# Altium schematic sheet Peripherals.SchDoc
size A3; SheetNumber: 3; SheetTotal: 10
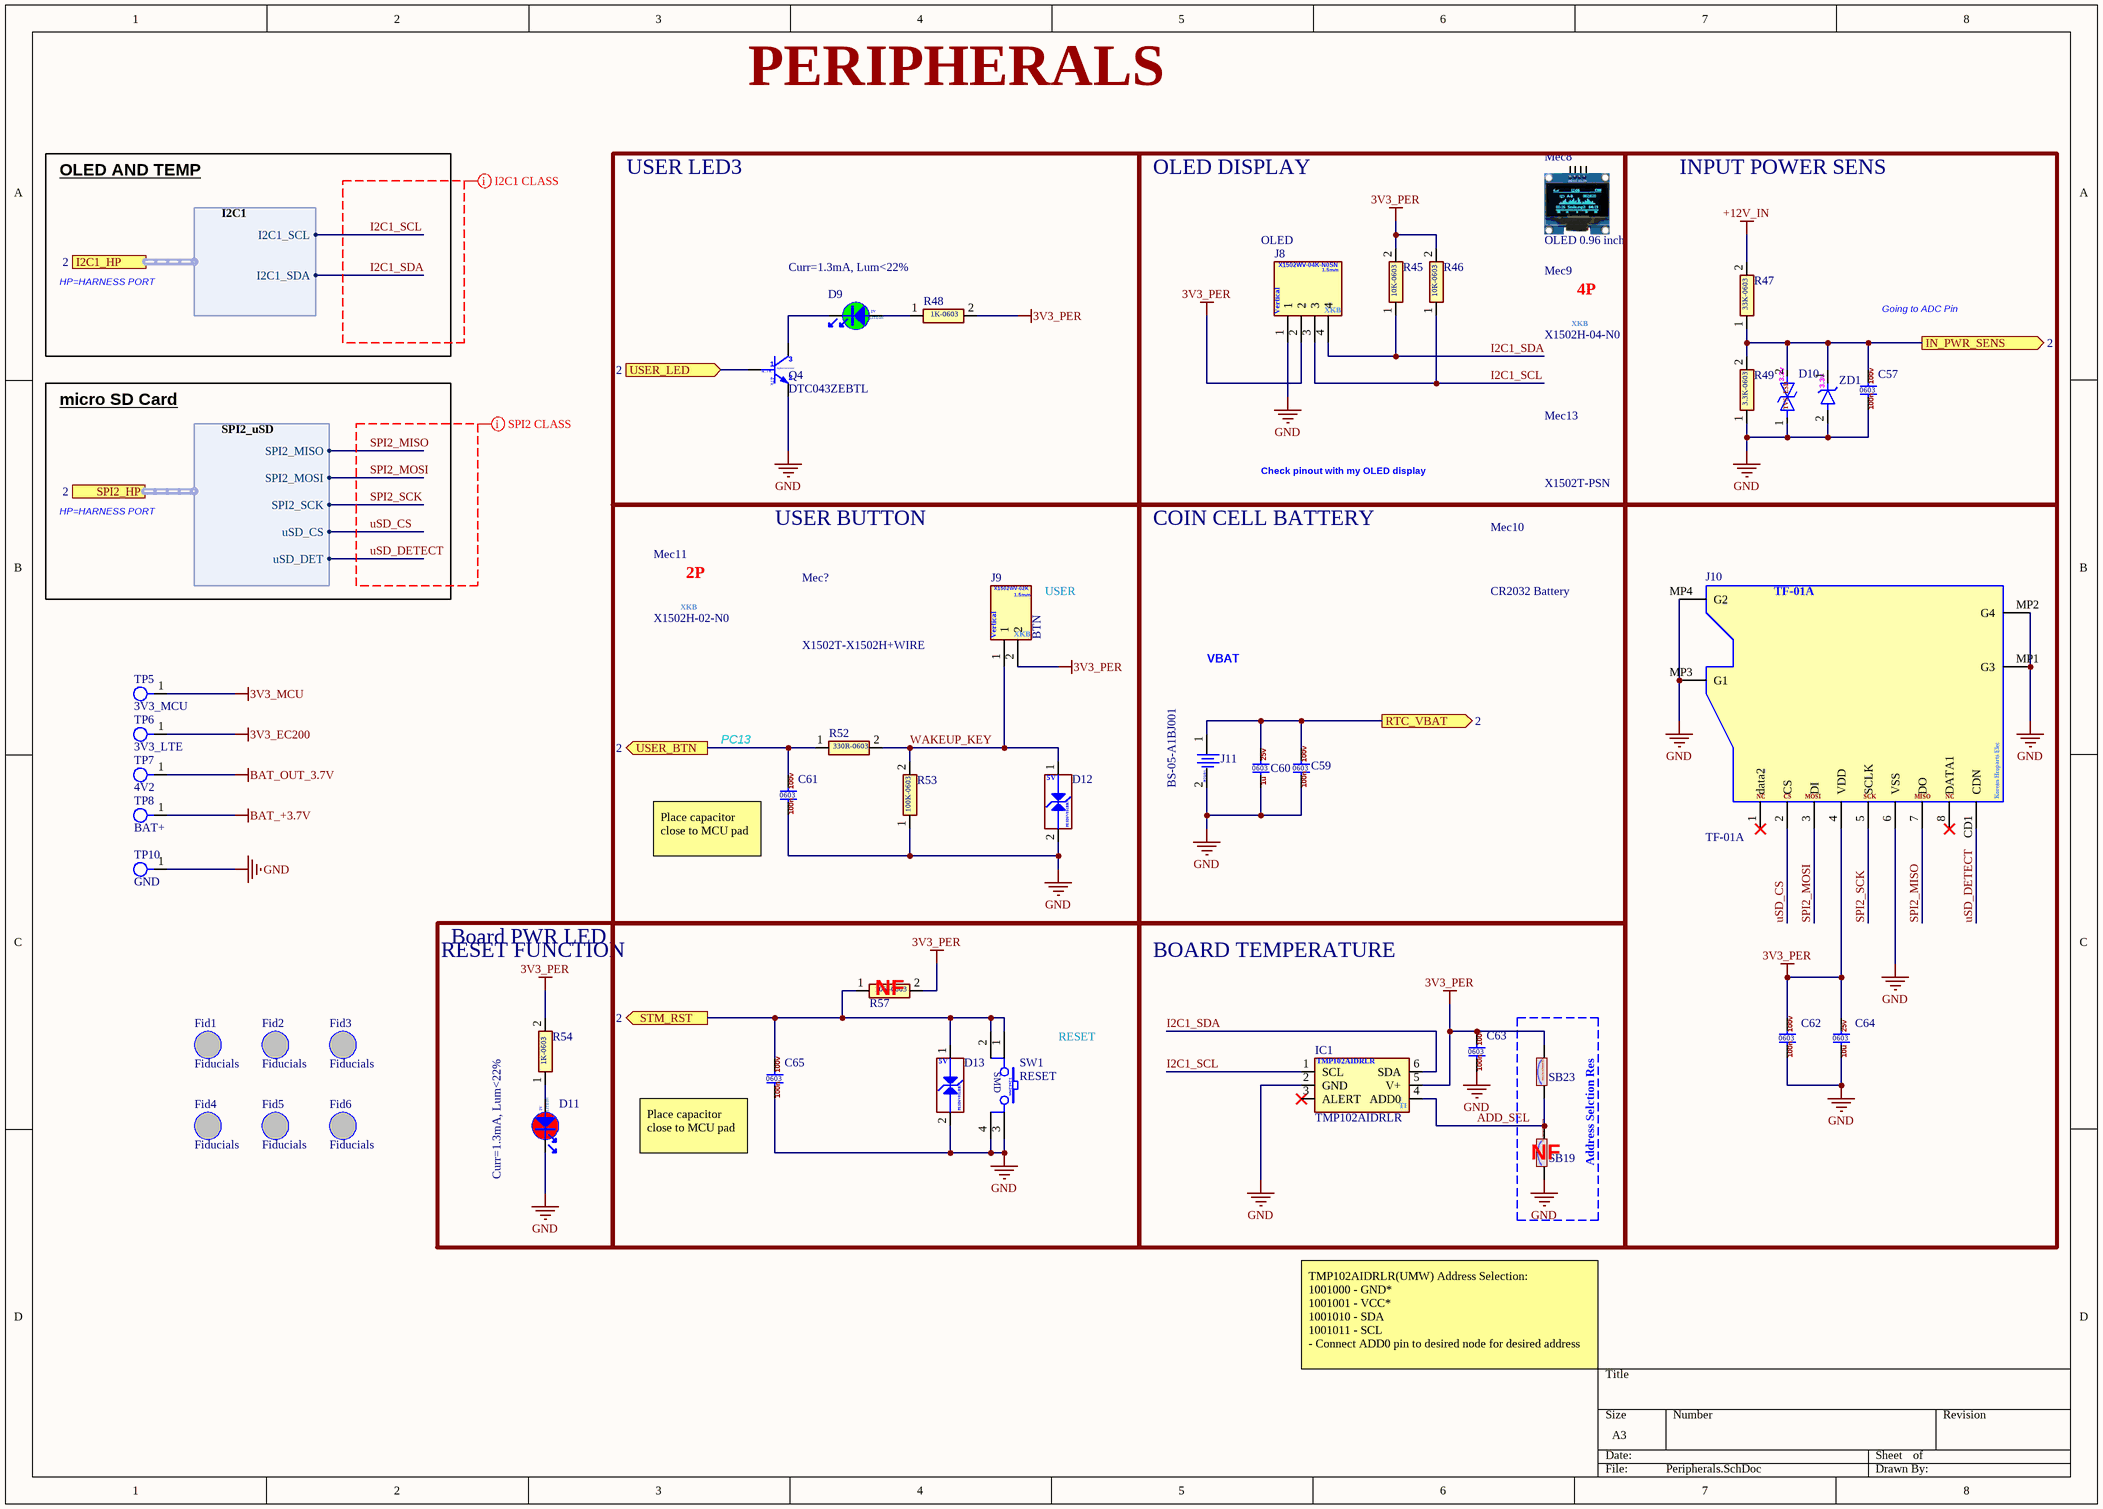
[diagram p0: Peripherals.SchDoc]

## Parts
C57  CL10B104KC8NNNC  [0603-CAP]  (value not drawn)
C59  CL10B104KC8NNNC  [0603-CAP]  (value not drawn)
C60  CL10B105KA8NNNC  [0603-CAP]  (value not drawn)
C61  CL10B104KC8NNNC  [0603-CAP]  (value not drawn)
C62  CL10B104KC8NNNC  [0603-CAP]  (value not drawn)
C63  CL10B104KC8NNNC  [0603-CAP]  (value not drawn)
C64  CL10A106MA8NRNC  [0603-CAP]  (value not drawn)
C65  CL10B104KC8NNNC  [0603-CAP]  (value not drawn)
D9  LTST-C170KGKT  [0805-LED-BLUE]  (value not drawn)
D10  UDD32C03L01  [SOD-323-2]  (value not drawn)
D11  LTST-C170KRKT  [0805-LED-RED]  (value not drawn)
D12  PESD5V0S1BBN  [SOD-523 SOD2512X110N]  (value not drawn)
D13  PESD5V0S1BBN  [SOD-523 SOD2512X110N]  (value not drawn)
Fid1  Fiducials  [Fiducials]
Fid2  Fiducials  [Fiducials]
Fid3  Fiducials  [Fiducials]
Fid4  Fiducials  [Fiducials]
Fid5  Fiducials  [Fiducials]
Fid6  Fiducials  [Fiducials]
IC1  TMP102AIDRLR  [SOT-563]
J8  OLED  [JST 4P 1.5MM VERTICAL]
J9  BTN  [JST 2P 1.5MM VERTICAL]
J10  TF-01A  [TF-01A]
J11  BS-05-A1BJ001  [BAT-TH_BS-05-A1BJ001]
Mec8  OLED 0.96 inch  (mechanical)
Mec9  X1502H-04-N0  (mechanical)
Mec10  CR2032 Battery  (mechanical)
Mec11  X1502H-02-N0  (mechanical)
Mec13  X1502T-PSN  (mechanical)
Mec?  X1502T-X1502H+WIRE  (mechanical)
Q4  DTC043ZEBTL  [SOT-416FL]
R45  0603WAF1002T5E  [0603-RES]  (value not drawn)
R46  0603WAF1002T5E  [0603-RES]  (value not drawn)
R47  0603WAF3302T5E  [0603-RES]  (value not drawn)
R48  0603WAF1001T5E  [0603-RES]  (value not drawn)
R49  0603WAF3301T5E  [0603-RES]  (value not drawn)
R52  0603WAF3300T5E  [0603-RES]  (value not drawn)
R53  0603WAF1003T5E  [0603-RES]  (value not drawn)
R54  0603WAF1001T5E  [0603-RES]  (value not drawn)
R57  0603WAF1002T5E  [0603-RES]  (value not drawn)
SB19  0603WAF0000T5E  [SOLDER-BRIDGE_R0603-0R]  (value not drawn)
SB23  0603WAF0000T5E  [SOLDER-BRIDGE_R0603-0R]  (value not drawn)
SW1  RESET  [SW TACTILE 4P]
TP5  3V3_MCU  [Test Pad FP]
TP6  3V3_LTE  [Test Pad FP]
TP7  4V2  [Test Pad FP]
TP8  BAT+  [Test Pad FP]
TP10  GND  [Test Pad FP]
ZD1  BZT52C3V3  [SOD-123F-2]  (value not drawn)

## Blocks framed on the sheet
USER LED3: D9 Q4 R48
OLED DISPLAY: J8 Mec8 Mec9 Mec13 R45 R46
INPUT POWER SENS: C57 D10 R47 R49 ZD1
USER BUTTON: C61 D12 J9 Mec11 Mec? R52 R53
COIN CELL BATTERY: C59 C60 J11 Mec10
Board PWR LED: D11 R54
BOARD TEMPERATURE: C63 IC1
NF: SB19 SB23

## Ports
I2C1_HP (harness I2C1, see 2), IN_PWR_SENS (out, see 2), RTC_VBAT (out, see 2), SPI2_HP (harness SPI2_uSD, see 2), STM_RST (out, see 2), USER_BTN (out, see 2), USER_LED (in, see 2)

## Harnesses
I2C1: I2C1_SCL, I2C1_SDA
SPI2_uSD: uSD_CS, SPI2_MISO, SPI2_MOSI, SPI2_SCK, uSD_DET

## Nets
3V3_EC200: TP6.1
3V3_MCU: TP5.1
3V3_PER: C62.2 C63.2 C64.2 IC1.5(V+) J8.2 J9.2 J10.4(VDD) R45.2 R46.2 R48.2 R54.2 R57.2 SB23.2
+12V_IN: R47.2
BAT_+3.7V: TP8.1
BAT_OUT_3.7V: TP7.1
GND: C57.1 C59.1 C60.1 C61.1 C62.1 C63.1 C64.1 C65.1 D10.1(K) D11.2 D12.2(GND) D13.2(GND) IC1.2(GND) J8.1 J10.6(VSS) J10.MP1(G3) J10.MP2(G4) J10.MP3(G1) J10.MP4(G2) J11.2 Q4.2(E) R49.1 R53.1 SB19.2 SW1.3 SW1.4 TP10.1 ZD1.2
ADD_SEL: IC1.4(ADD0) SB19.1 SB23.1
I2C1_SCL: IC1.1(SCL) J8.3 R46.1 ; port I2C1_HP.I2C1_SCL
I2C1_SDA: IC1.6(SDA) J8.4 R45.1 ; port I2C1_HP.I2C1_SDA
IN_PWR_SENS: C57.2 D10.2(A) R47.1 R49.2 ZD1.1 ; port IN_PWR_SENS
RTC_VBAT: C59.2 C60.2 J11.1 ; port RTC_VBAT
SPI2_MISO: J10.7(DO) ; port SPI2_HP.SPI2_MISO
SPI2_MOSI: J10.3(DI) ; port SPI2_HP.SPI2_MOSI
SPI2_SCK: J10.5(SCLK) ; port SPI2_HP.SPI2_SCK
STM_RST: C65.2 D13.1(IO1) R57.1 SW1.1 SW1.2 ; port STM_RST
uSD_CS: J10.2(CS) ; port SPI2_HP.uSD_CS
uSD_DETECT: J10.CD1(CDN) ; port SPI2_HP.uSD_DET
USER_BTN: C61.2 R52.1 ; port USER_BTN
USER_LED: Q4.1(B) ; port USER_LED
WAKEUP_KEY: D12.1(IO1) J9.1 R52.2 R53.2
NetD9_1: D9.1 R48.1
NetD9_2: D9.2 Q4.3(C)
NetD11_1: D11.1 R54.1

Not connected (* = marked no-connect by the designer): IC1 3(ALERT)*; J10 1(data2)* 8(DATA1)*

## Layout directives
net class SPI2_CLASS; rule Matched Net Lengths [Tolerance = 19.685mil]: SPI2_MISO, SPI2_MOSI, SPI2_SCK, uSD_CS, uSD_DETECT
net class I2C1_CLASS; rule Matched Net Lengths [Tolerance = 19.685mil]: I2C1_SCL, I2C1_SDA

## Notes on the sheet
- PERIPHERALS
- OLED AND TEMP
- HP=HARNESS PORT
- Curr=1.3mA, Lum<22%
- Going to ADC Pin
- micro SD Card
- Check pinout with my OLED display
- (near J9) USER
- VBAT
- PC13
- (near C61) Place capacitor close to MCU pad
- RESET FUNCTION
- (near R57) NF
- RESET
- (near C65) Place capacitor close to MCU pad
- Address Selction Res
- TMP102AIDRLR(UMW) Address Selection:
  1001000 - GND*
  1001001 - VCC*
  1001010 - SDA
  1001011 - SCL
  - Connect ADD0 pin to desired node for desired address
- (in symbol 0603WAF1001T5E) 1K-0603
- (in symbol 0603WAF1002T5E) 10K-0603
- (in symbol 0603WAF1003T5E) 100K-0603
- (in symbol 0603WAF3300T5E) 330R-0603
- (in symbol 0603WAF3301T5E) 3.3K-0603
- (in symbol 0603WAF3302T5E) 33K-0603
- (in symbol BS-05-A1BJ001) Vertical
- (in symbol BZT52C3V3) 3.3v
- (in symbol CL10A106MA8NRNC) 25v; 0603; 10u
- (in symbol CL10B104KC8NNNC) 100v; 0603; 100n
- (in symbol CL10B105KA8NNNC) 25v; 0603; 1u
- (in symbol DTC043ZEBTL) digital transistor; 4.7k; 47k
- (in symbol LTST-C170KGKT) 2V; LITEON
- (in symbol LTST-C170KRKT) 2V; LITEON
- (in symbol PESD5V0S1BBN) 5V
- (in symbol TF-01A) NC; MOSI; SCK; MISO; Korean Hroparts Elec
- (in symbol TMP102AIDRLR) TI
- (in symbol TS-1145A-B-A) SMD; 3.2x4.2mm
- (in symbol UDD32C03L01) 3.3v; ESD; TVS
- (in symbol X1502H-02-N0) 2P; XKB
- (in symbol X1502H-04-N0) 4P; XKB
- (in symbol X1502WV-02K-N0SN) X1502WV-02K; 1.5mm; Vertical; XKB
- (in symbol X1502WV-04K-N0SN) 1.5mm; Vertical; XKB

## Library data of the parts
C57 C59 C61-C63 C65 = CL10B104KC8NNNC: CAP: CER 100NF 100V X7R 0603; POC Price: 0.006; LCSC Part #: C15725; Unit Price: 0.0036; ComponentLink1Description: DS; ComponentLink1URL: https://www.lcsc.com/datasheet/C15725.pdf
C60 = CL10B105KA8NNNC: CAP: CER 1UF 25V X7R 0603; LCSC Part #: C29936; Unit Price: 0.0027; ComponentLink1Description: DS; ComponentLink1URL: https://www.lcsc.com/datasheet/C29936.pdf
C64 = CL10A106MA8NRNC: CAP: CER 10UF 25V X5R 0603; LCSC Part #: C96446; Unit Price: 0.01; ComponentLink1Description: DS; ComponentLink1URL: https://www.lcsc.com/datasheet/C96446.pdf
D9 = LTST-C170KGKT: LED: GREEN 20mA 35mcd Water Clear -55℃~+85℃ 571nm Yellow Green 130° 75mW 2V 0805 LED Indication - Discrete ROHS; POC Price: 0.0216; LCSC Part #: C98221; Unit Price: 0.0095; ComponentLink1Description: DS; ComponentLink1URL: https://www.lcsc.com/datasheet/C98221.pdf
D10 = UDD32C03L01: DIODE TVS: 3.3V 19A 15V 4V BidirectionalESD and Surge Protection (TVS/ESD) ROHS  SOD-323; POC Price: 0.0344; LCSC Part #: C78439; Unit Price: 0.0172; ComponentLink1Description: DS; ComponentLink1URL: https://www.lcsc.com/datasheet/C78439.pdf
D11 = LTST-C170KRKT: LED: RED 20mA 54mcd Colorless Transparent Lens -55℃~+85℃ 631nm Red 130° 75mW 2V 0805 LED; POC Price: 0.0229; LCSC Part #: C94868; Unit Price: 0.0107
D12 D13 = PESD5V0S1BBN: DIODE ESD: 5A 75W@8/20us 15V 6V Bidirectional 5V SOD-523 ESD and Surge Protection (TVS/ESD); POC Price: 0.0232; LCSC Part #: C314264; Unit Price: 0.0106; ComponentLink1Description: DS; ComponentLink1URL: https://www.lcsc.com/datasheet/C314264.pdf
IC1 = TMP102AIDRLR: SEN: TEMP TI TMP102AIDRLR Temperature sensor / SOT-563; POC Price: 0.2045; LCSC Part #: C99269; Unit Price: 0.1007; ComponentLink1Description: DS; ComponentLink1URL: https://www.lcsc.com/datasheet/C99269.pdf
J8 = X1502WV-04K-N0SN: JST: Vertical, P1.5mm TH, 4P, Wire To Board Connector, 1A (Housing: X1502H-04-N0 - C697055); POC Price: 0.0307; LCSC Part #: C561527; Unit Price: 0.0141; ComponentLink1Description: DS; ComponentLink1URL: https://www.lcsc.com/datasheet/C561527.pdf
J9 = X1502WV-02K-N0SN: JST: Vertical, P1.5mm TH, 2P, Wire To Board Connector, 1A (Housing: X1502H-02-N0 - C697053); POC Price: 0.0156; LCSC Part #: C561525; Unit Price: 0.0071; ComponentLink1Description: DS; ComponentLink1URL: https://www.lcsc.com/datasheet/C561525.pdf
J10 = TF-01A: Micro-sd card: 1.85mm Connector and Ejector MicroSD Card (TF Card) Push-Push SMD SD Card / Memory Card Connector ROHS; POC Price: 0.1724; ComponentLink1Description: DS; ComponentLink1URL: https://www.lcsc.com/datasheet/C91145.pdf; LCSC Part #: C91145; Unit Price: 0.0922
J11 = BS-05-A1BJ001: Battery Con: CR2032, RTC, Connector, Vertical; POC Price: 0.1585; LCSC Part #: C964752; Unit Price: 0.0766; ComponentLink1Description: DS; ComponentLink1URL: https://www.lcsc.com/datasheet/C964752.pdf
Mec8 = OLED 0.96 inch: OLED: OLED 0.96 inch LED, DISPLAY; POC Price: 2.2; ComponentLink1Description: Purchase link; ComponentLink1URL: https://store.roboticsbd.com/arduino-shield/1328-096-inch-i2c-oled-display-white-robotics-bangladesh.html?srsltid=AfmBOoov87Sur0oLopDQguXRmOqb7O4VOpYo566uxhe8bvAyIzZHciV9; Unit Price: 1.2
Mec9 = X1502H-04-N0: JST Housing: P1.5mm, 4P, Wire To Board; POC Price: 0.0139; LCSC Part #: C697055; Unit Price: 0.0063; ComponentLink1Description: DS; ComponentLink1URL: https://www.lcsc.com/datasheet/C697055.pdf
Mec10 = CR2032 Battery: POC Price: 0.4; ComponentLink1Description: Purchase Link; ComponentLink1URL: https://techshopbd.com/product/lithium-battery-maxell-cr2032; Unit Price: 0.25
Mec11 = X1502H-02-N0: JST Housing: P1.5mm, 2P, Wire To Board; POC Price: 0.0042; LCSC Part #: C697053; Unit Price: 0.0036; ComponentLink1Description: DS; ComponentLink1URL: https://www.lcsc.com/datasheet/C697053.pdf
Mec13 = X1502T-PSN: Con: Rectangular Connector Contacts ROHS; JST; HOUSING; P1.5mm; 2P; 3P; 4P; WIRE TO BOARD; X1502H; X1503H; X1504H; X1505H; X1506H; X1502T; X1503T; X1504T; X1505T; X1506T; POC Price: 0.005; LCSC Part #: C780064; Unit Price: 0.0024; ComponentLink1Description: DS; ComponentLink1URL: https://www.lcsc.com/datasheet/C780064.pdf
Mec? = X1502T-PSN-A28RB-L100-T3: Hook-Up Wire: Housing+contact; Single Conductor Cables (Hook-Up Wire); JST; HOUSING; P1.5mm; 2P; WIRE TO BOARD; X1502H; X1502T; 28 AWG; POC Price: 0.0789; LCSC Part #: C6118644; Unit Price: 0.0727; ComponentLink1Description: DS
Q4 = DTC043ZEBTL: Transistor digital: 80@10mA,5V 150mW 100mA 50V SOT-416FL Digital Transistors ROHS; LCSC Part #: C96459; Unit Price: 0.0094
R45 R46 R57 = 0603WAF1002T5E: RES: 10K OHM 1% 100mW 0603 75V; LCSC Part #: C25804; Unit Price: 0.0005; ComponentLink1Description: DS; ComponentLink1URL: https://www.lcsc.com/datasheet/C25804.pdf
R47 = 0603WAF3302T5E: RES: 33K OHM 1% 100mW 0603 75V; LCSC Part #: C4216; Unit Price: 0.0006; ComponentLink1Description: DS; ComponentLink1URL: https://www.lcsc.com/datasheet/C4216.pdf
R48 R54 = 0603WAF1001T5E: RES: 1K OHM 1% 100mW 0603 75V; LCSC Part #: C21190; Unit Price: 0.0005; ComponentLink1Description: DS; ComponentLink1URL: https://www.lcsc.com/datasheet/C21190.pdf
R49 = 0603WAF3301T5E: RES: 3.3K OHM 1% 100mW 0603 75V; POC Price: 0.001; LCSC Part #: C22978; Unit Price: 0.0006; ComponentLink1Description: DS; ComponentLink1URL: https://www.lcsc.com/datasheet/C4216.pdf
R52 = 0603WAF3300T5E: RES: 330 OHM 1% 100mW 0603 75V; POC Price: 0.0011; LCSC Part #: C23138; Unit Price: 0.0006; ComponentLink1Description: DS; ComponentLink1URL: https://www.lcsc.com/datasheet/C23138.pdf
R53 = 0603WAF1003T5E: RES: 100K OHM 1% 100mW 0603 75V; LCSC Part #: C25803; Unit Price: 0.0006; ComponentLink1Description: DS; ComponentLink1URL: https://www.lcsc.com/datasheet/C25803.pdf
SB19 SB23 = 0603WAF0000T5E: Solder Bridge: ON SB 0603; LCSC Part #: C21189; Unit Price: 0.0006; ComponentLink1Description: DS; ComponentLink1URL: https://www.lcsc.com/datasheet/C21189.pdf
SW1 = TS-1145A-B-A: SW: 3.2mm 2.5mm Oval push button Standing paste SPST SMD Tactile Switches ROHS; POC Price: 0.0495; LCSC Part #: C318904; Unit Price: 0.0242; ComponentLink1Description: DS; ComponentLink1URL: https://www.lcsc.com/datasheet/C318904.pdf
TP5-TP8 TP10 = Test Pad: TESTPAD: Test Pad
ZD1 = BZT52C3V3: DIODE: 3.3V ZENER 3.14V~3.47V 500mW 3.3V SOD-123 Zener Diodes ROHS; POC Price: 0.0129; LCSC Part #: C173413; Unit Price: 0.006; ComponentLink1Description: DS; ComponentLink1URL: https://www.lcsc.com/datasheet/C173413.pdf